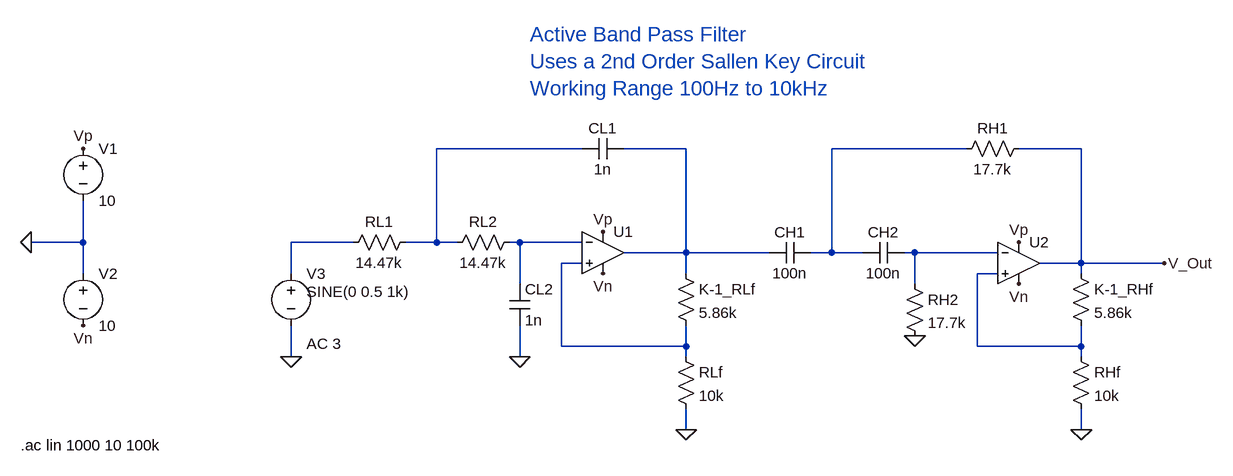
[diagram p0: schematic Active_Band_Pass_Filter.asc]
Active_Band_Pass_Filter.asc, the LTspice schematic file:
Version 4.1
SHEET 1 1688 680
WIRE 704 16 480 16
WIRE 864 16 768 16
WIRE 1296 16 1088 16
WIRE 1472 16 1376 16
WIRE -64 160 -64 96
WIRE -64 160 -144 160
WIRE 352 160 256 160
WIRE 480 160 480 16
WIRE 480 160 432 160
WIRE 512 160 480 160
WIRE 608 160 592 160
WIRE 704 160 608 160
WIRE 864 176 864 16
WIRE 864 176 768 176
WIRE 992 176 864 176
WIRE 1088 176 1088 16
WIRE 1088 176 1056 176
WIRE 1136 176 1088 176
WIRE 1216 176 1200 176
WIRE 1344 176 1216 176
WIRE 704 192 672 192
WIRE 1472 192 1472 16
WIRE 1472 192 1408 192
WIRE 1600 192 1472 192
WIRE -64 208 -64 160
WIRE 256 208 256 160
WIRE 864 208 864 176
WIRE 1344 208 1312 208
WIRE 1472 208 1472 192
WIRE 608 224 608 160
WIRE 1216 224 1216 176
WIRE 672 320 672 192
WIRE 864 320 864 288
WIRE 864 320 672 320
WIRE 1312 320 1312 208
WIRE 1472 320 1472 288
WIRE 1472 320 1312 320
WIRE 256 336 256 288
WIRE 608 336 608 288
WIRE 864 336 864 320
WIRE 1472 336 1472 320
WIRE 864 448 864 416
WIRE 1472 448 1472 416
FLAG -144 160 0
FLAG 256 336 0
FLAG 608 336 0
FLAG 864 448 0
FLAG 1216 304 0
FLAG 1472 448 0
FLAG -64 16 Vp
FLAG 736 144 Vp
FLAG 1376 160 Vp
FLAG -64 288 Vn
FLAG 736 208 Vn
FLAG 1376 224 Vn
FLAG 1600 192 V_Out
SYMBOL voltage -64 0 R0
WINDOW 123 0 0 Left 0
WINDOW 39 0 0 Left 0
SYMATTR InstName V1
SYMATTR Value 10
SYMBOL voltage -64 192 R0
WINDOW 123 0 0 Left 0
WINDOW 39 0 0 Left 0
SYMATTR InstName V2
SYMATTR Value 10
SYMBOL voltage 256 192 R0
WINDOW 123 24 124 Left 2
WINDOW 39 0 0 Left 0
WINDOW 3 24 44 Left 2
SYMATTR Value2 AC 3
SYMATTR InstName V3
SYMATTR Value SINE(0 0.5 1k)
SYMBOL res 448 144 R90
WINDOW 0 0 56 VBottom 2
WINDOW 3 32 56 VTop 2
SYMATTR InstName RL1
SYMATTR Value 14.47k
SYMBOL res 608 144 R90
WINDOW 0 0 56 VBottom 2
WINDOW 3 32 56 VTop 2
SYMATTR InstName RL2
SYMATTR Value 14.47k
SYMBOL cap 768 0 R90
WINDOW 0 0 32 VBottom 2
WINDOW 3 32 32 VTop 2
SYMATTR InstName CL1
SYMATTR Value 1n
SYMBOL OpAmps\\UniversalOpAmp2 736 176 R0
SYMATTR InstName U1
SYMBOL cap 592 224 R0
SYMATTR InstName CL2
SYMATTR Value 1n
SYMBOL res 848 192 R0
SYMATTR InstName K-1_RLf
SYMATTR Value 5.86k
SYMBOL res 848 320 R0
SYMATTR InstName RLf
SYMATTR Value 10k
SYMBOL cap 1056 160 R90
WINDOW 0 0 32 VBottom 2
WINDOW 3 32 32 VTop 2
SYMATTR InstName CH1
SYMATTR Value 100n
SYMBOL cap 1200 160 R90
WINDOW 0 0 32 VBottom 2
WINDOW 3 32 32 VTop 2
SYMATTR InstName CH2
SYMATTR Value 100n
SYMBOL res 1392 0 R90
WINDOW 0 0 56 VBottom 2
WINDOW 3 32 56 VTop 2
SYMATTR InstName RH1
SYMATTR Value 17.7k
SYMBOL res 1456 192 R0
SYMATTR InstName K-1_RHf
SYMATTR Value 5.86k
SYMBOL res 1456 320 R0
SYMATTR InstName RHf
SYMATTR Value 10k
SYMBOL OpAmps\\UniversalOpAmp2 1376 192 R0
SYMATTR InstName U2
SYMBOL res 1200 208 R0
SYMATTR InstName RH2
SYMATTR Value 17.7k
TEXT -160 472 Left 2 !.ac lin 1000 10 100k
TEXT 624 -160 Left 3 ;Active Band Pass Filter \nUses a 2nd Order Sallen Key Circuit\nWorking Range 100Hz to 10kHz

The netlist it stands for:
* Active_Band_Pass_Filter.asc
V1 Vp 0 10
V2 0 Vn 10
V3 N004 0 SINE(0 0.5 1k) AC 3
RL1 N001 N004 14.47k
RL2 N005 N001 14.47k
CL1 N002 N001 1n
X§U1 N007 N005 Vp Vn N002 level2 Avol=1Meg GBW=10Meg Slew=10Meg Ilimit=25m Rail=0 Vos=0 En=0 Enk=0 In=0 Ink=0 Rin=500Meg  ; pins In+ In- V+ V- OUT
CL2 N005 0 1n
R§K-1_RLf N002 N007 5.86k
RLf N007 0 10k
CH1 N003 N002 100n
CH2 N006 N003 100n
RH1 V_Out N003 17.7k
R§K-1_RHf V_Out N008 5.86k
RHf N008 0 10k
X§U2 N008 N006 Vp Vn V_Out level2 Avol=1Meg GBW=10Meg Slew=10Meg Ilimit=25m Rail=0 Vos=0 En=0 Enk=0 In=0 Ink=0 Rin=500Meg  ; pins In+ In- V+ V- OUT
RH2 N006 0 17.7k
.ac lin 1000 10 100k
* Active Band Pass Filter
* Uses a 2nd Order Sallen Key Circuit
* Working Range 100Hz to 10kHz
.lib UniversalOpAmp2.lib
.backanno
.end